# Altium schematic sheet USB.SchDoc: USB with connector
size A3; Organization: Reichle & De-Massari; Address1: Binzstrasse 32; Address2: 8620 Wetzikon; Address3: Switzerland; DocumentNumber: 6; Revision: V0.1; SheetNumber: 6; SheetTotal: 11
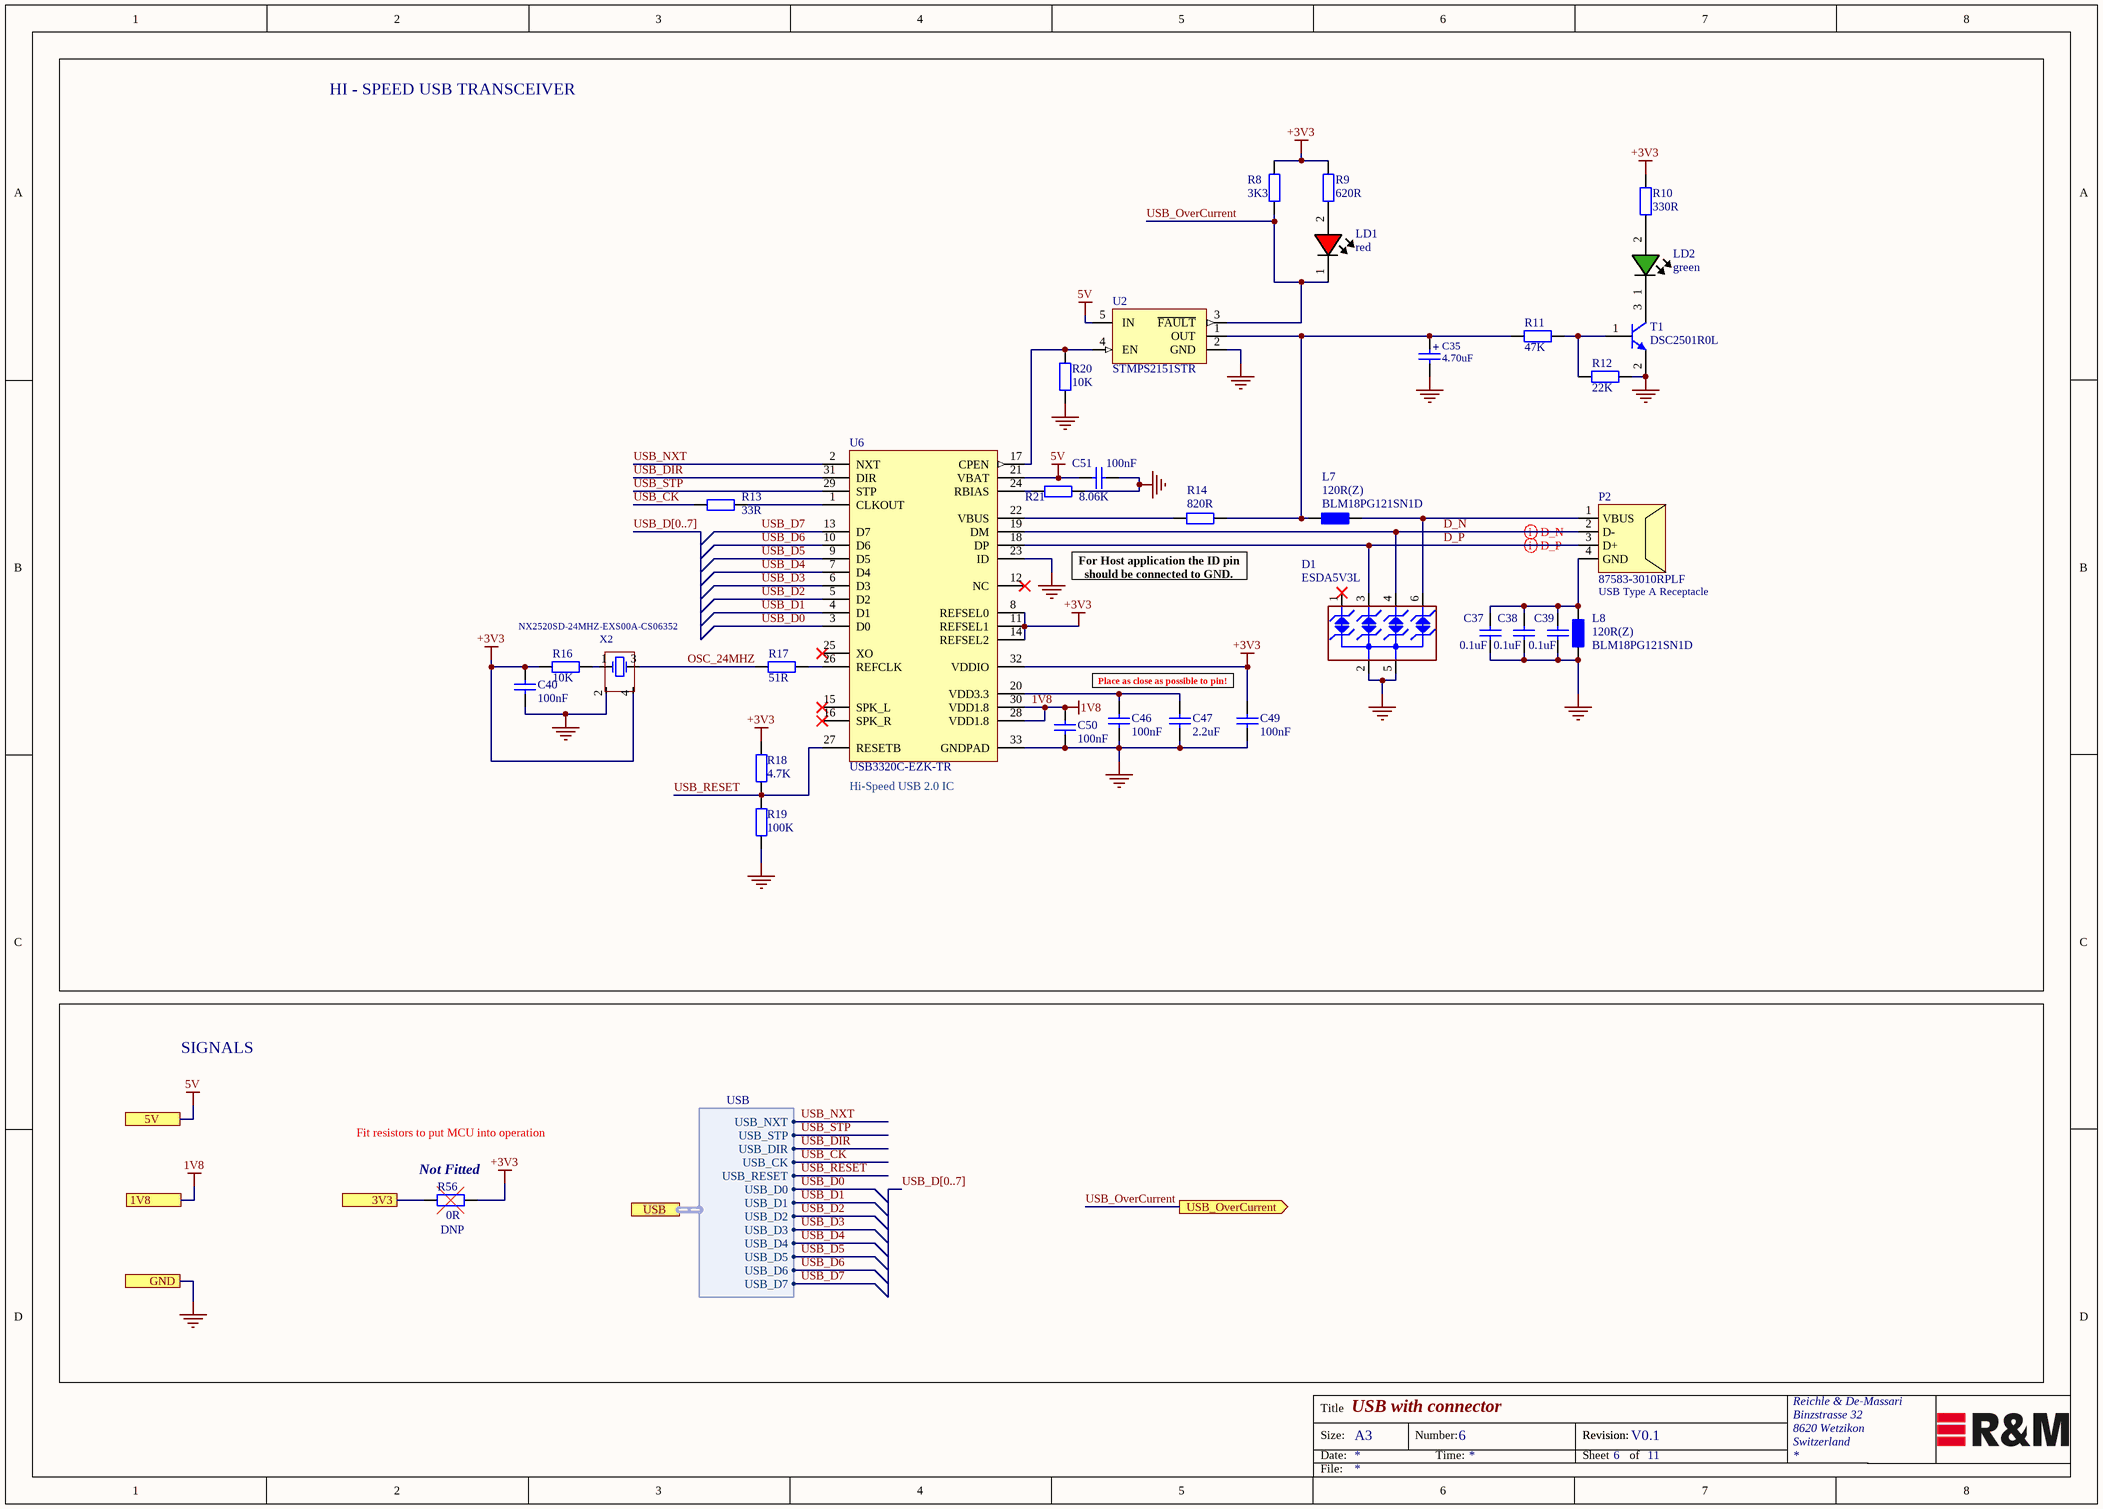
[diagram p0: USB.SchDoc]

## Parts
C35  4.70uF  [CAPC1608X90]
C37  0.1uF  [Ceramic Capacitor 0402 EIA]
C38  0.1uF  [Ceramic Capacitor 0402 EIA]
C39  0.1uF  [Ceramic Capacitor 0402 EIA]
C40  100nF  [Ceramic Capacitor 0402 EIA]
C46  100nF  [Ceramic Capacitor 0402 EIA]
C47  2.2uF  [Ceramic Capacitor 0402 EIA]
C49  100nF  [Ceramic Capacitor 0402 EIA]
C50  100nF  [Ceramic Capacitor 0402 EIA]
C51  100nF  [Ceramic Capacitor 0402 EIA]
D1  ESDA5V3L  [SOT23-6L]
L7  120R(Z)  Manufacturer PartNr: BLM18PG121SN1D  [Inductor 0603 EIA]
L8  120R(Z)  Manufacturer PartNr: BLM18PG121SN1D  [Inductor 0603 EIA]
LD1  red  [LED_APHHS1005CGCK]
LD2  green  [LED_APHHS1005CGCK]
P2  87583-3010RPLF  [CONN_RCPT_USB_TYPE_A]
R8  3K3  [Resistor 0402 EIA]
R9  620R  [Resistor 0402 EIA]
R10  330R  [Resistor 0402 EIA]
R11  47K  [Resistor 0402 EIA]
R12  22K  [Resistor 0402 EIA]
R13  33R  [Resistor 0402 EIA]
R14  820R  [Resistor 0402 EIA]
R16  10K  [Resistor 0402 EIA]
R17  51R  [Resistor 0402 EIA]
R18  4.7K  [Resistor 0402 EIA]
R19  100K  [Resistor 0402 EIA]
R20  10K  [Resistor 0402 EIA]
R21  8.06K  [Resistor 0402 EIA]
R56  DNP  [Resistor 0805 EIA]
T1  DSC2501R0L  [SOT-23/TO-236AA]
U2  STMPS2151STR  [SOT23-5L]
U6  USB3320C-EZK-TR  [QFN32_0R5_5X5]
X2  NX2520SD-24MHZ-EXS00A-CS06352  [NX2520SD-24MHZ-EX]

## Blocks framed on the sheet
HI - SPEED USB TRANSCEIVER: C35 C37-C40 C46 C47 C49-C51 D1 L7 L8 LD1 LD2 P2 R8-R14 R16-R21 T1 U2 U6 X2
SIGNALS: R56

## Ports
1V8, 3V3, 5V, GND, USB (harness USB), USB_OverCurrent (out)

## Harnesses
USB: USB_STP, USB_DIR, USB_CK, USB_NXT, USB_RESET, USB_D0, USB_D1, USB_D2, USB_D3, USB_D4, USB_D5, USB_D6, USB_D7

## Nets
1V8: C50.2 U6.28(VDD1.8) U6.30(VDD1.8) ; port 1V8
5V: C51.2 U2.5(IN) U6.21(VBAT) ; port 5V
+3V3: C40.2 C49.2 R8.2 R9.1 R10.1 R16.1 R18.1 R56.2 U6.8(REFSEL0) U6.11(REFSEL1) U6.14(REFSEL2) U6.32(VDDIO) X2.4(OSC3)
GND: C35.2(Neg) C37.1 C38.1 C39.1 C40.1 C46.1 C47.1 C49.1 C50.1 C51.1 D1.2(IO2) D1.5(IO4) L8.1 R12.2 R19.2 R20.2 R21.2 T1.2(E) U2.2(GND) U6.23(ID) U6.33(GNDPAD) X2.2(OSC2) ; port GND
3V3: R56.1 ; port 3V3
D_N: D1.4(IO3) P2.2(D-) U6.19(DM)
D_P: D1.3(GND) P2.3(D+) U6.18(DP)
OSC_24MHZ: R17.1 X2.3(OSC2)
USB_CK: R13.1 ; port USB.USB_CK
USB_D0: U6.3(D0) ; port USB.USB_D0
USB_D1: U6.4(D1) ; port USB.USB_D1
USB_D2: U6.5(D2) ; port USB.USB_D2
USB_D3: U6.6(D3) ; port USB.USB_D3
USB_D4: U6.7(D4) ; port USB.USB_D4
USB_D5: U6.9(D5) ; port USB.USB_D5
USB_D6: U6.10(D6) ; port USB.USB_D6
USB_D7: U6.13(D7) ; port USB.USB_D7
USB_DIR: U6.31(DIR) ; port USB.USB_DIR
USB_NXT: U6.2(NXT) ; port USB.USB_NXT
USB_OverCurrent: LD1.1 R8.1 U2.3(~{FAULT}) ; port USB_OverCurrent
USB_RESET: R18.2 R19.1 U6.27(RESETB) ; port USB.USB_RESET
USB_STP: U6.29(STP) ; port USB.USB_STP
NetC35_1: C35.1(Pos) L7.1 R11.1 R14.2 U2.1(OUT)
NetC37_2: C37.2 C38.2 C39.2 L8.2 P2.4(GND)
NetC46_2: C46.2 C47.2 U6.20(VDD3.3)
NetD1_6: D1.6(NC) L7.2 P2.1(VBUS)
NetLD2_2: LD2.2 R10.2
NetR11_2: R11.2 R12.1 T1.1(B)
NetR13_2: R13.2 U6.1(CLKOUT)
NetR14_1: R14.1 U6.22(VBUS)
NetR16_2: R16.2 X2.1(OSC1)
NetR17_2: R17.2 U6.26(REFCLK)
NetR20_1: R20.1 U2.4(EN) U6.17(CPEN)
NetR21_1: R21.1 U6.24(RBIAS)

Not connected (* = marked no-connect by the designer): D1 1(IO1)*; LD1 2; LD2 1; R9 2; T1 3(C); U6 12(NC)* 15(SPK_L)* 16(SPK_R)* 25(XO)*

## Buses and harness runs
bus USB_D[0..7]

## Layout directives
differential pair: D_N, D_P

## Notes on the sheet
- (near R14) For Host application the ID pin should be connected to GND.
- Place as close as possible to pin!
- (near U6) Hi-Speed USB 2.0 IC
- Fit resistors to put MCU into operation
- (near R56) Not Fitted
- (near R56) 0R
- Title
- Size:
- Date:
- A3
- Number:
- Time:
- Revision:
- Sheet
- of
- File:
- (in symbol Cap_4.7uF_0603_6V3_Tantal) +
- (in symbol CONN_USB_TYPE_A_1) USB Type A Receptacle

## Library data of the parts
C35 = Cap_4.7uF_0603_6V3_Tantal: 4.7µF Molded Tantalum Capacitors 6.3V 0603 (1608 Metric) 7.5Ohm; Manufacturer: AVX Corporation; Manufacturer PartNr: TACL475K006XTA; Replaceable: yes; tolerance: 10 %; Dielectric Grade: TAC; voltage: 6.3V; Footprint/Package: 0603 (1608 Metric); value: 4.70uF; Supplier 1: Digi-Key; Supplier Part Number 1: 478-7522-1-ND
C37-C39 = Cap_0.1uF_0402_16V: 0.1µF ±20% 16V Ceramic Capacitor X7R 0402 (1005 Metric); Manufacturer: KEMET; Manufacturer PartNr: C0402C104M4RACAUTO; voltage: 16VDC; Replaceable: yes; value: 0.1uF; tolerance: 20%; Footprint/Package: 0402 (1005 Metric); Dielectric Grade: X7R; ComponentLink1Description: mouser; ComponentLink1URL: https://www.mouser.ch/ProductDetail/KEMET/C0402C104M4RACAUTO?qs=sGAEpiMZZMs0AnBnWHyRQB295tntAovf0Dzw3tVX6zRfKTwHFThmZw%3d%3d; Supplier 1: Digi-Key; Supplier Part Number 1: 399-13707-1-ND
C40 C46 C49-C51 = Cap_100nF_0402_10V: 0,1µF ±10% 10V Keramikkondensatoren X7R 0402 (1005 metrisch); Manufacturer: Samsung; Manufacturer PartNr: CC0402KRX7R6BB104; Replaceable: yes; volatage: 10VDC; Dielectric Grade: X7R; Footprint/Package: 0402 (1005 metric); Supplier 1: Digi-Key; Supplier Part Number 1: 1276-1002-1-ND; value: 100nF
C47 = Cap_2.2uF_0402_6.3V: Multilayer Ceramic Capacitors MLCC - SMD/SMT 0402 2.2uF 6.3volts *Derate Voltage/Temp; Manufacturer: Murata; Manufacturer PartNr: GRM155R60J225ME15D; tolerance: ±20%; voltage: 6.3VDC; Replaceable: yes; Dielectric Grade: X5R; value: 2.2uF; Footprint/Package: 0402; ComponentLink1Description: digikey; ComponentLink1URL: https://www.digikey.com/product-detail/en/murata-electronics-north-america/GRM155R61E225ME15D/490-10457-2-ND/5027542; Supplier 1: Mouser; Supplier Part Number 1: 81-GRM155R60J225ME5D
D1 = ESDA6V1BC6: Clamp Ipp Tvs Diode Surface Mount SOT-23-6 SMD, used e.g in ESD protection for USB; Manufacturer: STMicroelectronics; Replaceable: no; voltage: 6.1V; value: ESDA5V3L; Manufacturer PartNr: ESDA6V1BC6; Dielectric Grade: -; Supplier Part Number 1: 497-6635-1-ND; Supplier 1: Digi-Key; Footprint/Package: SOT-23-6; tolerance: -
L7 L8 = Ferrit_Bead_0603_BLM18PG121SN1D: 120 Ohms @ 100MHz 1 Power Line Ferrite Bead 0603 (1608 Metric) 2A 50mOhm; Manufacturer: Murata Electronics; Replaceable: yes; value: 120R(Z); tolerance: -; power: -; Footprint/Package: 0603 (1608 metric); Supplier 1: Digi-Key; Supplier Part Number 1: 490-1037-1-ND; Dielectric Grade: -
LD1 = LED_RED_0402: Red 630nm LED Indication - Discrete 1.95V 0402 (1005 Metric); Manufacturer: Kingbright; Manufacturer PartNr: APHHS1005SURCK; Replaceable: yes; voltage: 1.95V (forward); Footprint/Package: 0420 (1005 metric); value: red; Supplier 1: Digi-Key; Supplier Part Number 1: 754-1104-1-ND; Dielectric Grade: -; tolerance: -; power: -
LD2 = LED_GREEN_0402: Green 570nm LED Indication - Discrete 2.1V 0402 (1005 Metric); Manufacturer: Kingbright; Manufacturer PartNr: APHHS1005CGCK; Replaceable: yes; voltage: 2.1V (forward); Footprint/Package: 0420 (1005 metric); value: green; Supplier 1: Digi-Key; Supplier Part Number 1: 754-1101-1-ND; Dielectric Grade: -; tolerance: -; power: -
P2 = CONN_USB_TYPE_A_1: USB - A USB 2.0 Receptacle Connector 4 Position Surface Mount, Right Angle; Manufacturer: Amphenol ICC; Replaceable: no; Footprint/Package: SMD, see datasheet; Supplier 1: Digi-Key; ComponentLink1Description: mouser; ComponentLink1URL: https://www.mouser.ch/ProductDetail/Harwin/M50-3030342?qs=%2fha2pyFaduiRpn7Sn9fWVp%252bNpdzGcgnS82sSCZLLu%2fUjQZVEB%252bIkNw%3d%3d; Supplier Part Number 1: 609-6260-1-ND; power: -; Dielectric Grade: -; Manufacturer PartNr: 87583-3010RPLF; voltage: -; value: 87583-3010RPLF
R8 = Res_3K3_0402: 3.3 kOhms ±0.1% 0.063W, 1/16W Chip Resistor 0402 (1005 Metric) Automotive AEC-Q200 Thin Film; Manufacturer: Panasonic Electronic Components; Manufacturer PartNr: ERA-2AEB332X; Replaceable: yes; Dielectric Grade: -; Footprint/Package: 0402 (1005metric); power: 0.063W, 1/16W; Supplier 1: Digi-Key; Supplier Part Number 1: P3.3KDCCT-ND; tolerance: ±0.1%; value: 3K3
R9 = Res_620R_0402: 620Ohm, SMD 0402,  1/16W  0.5%; Manufacturer: Susumu; Manufacturer PartNr: RR0510P-621-D; power: 62.5mW; Replaceable: yes; Footprint/Package: 0402 (1005 metric); Supplier 1: Mouser; Supplier Part Number 1: 754-RR0510P-621D; tolerance: 0.5%; value: 620R; ComponentLink1Description: mouser; ComponentLink1URL: https://www.mouser.ch/ProductDetail/Susumu/RR0510P-621-D?qs=sGAEpiMZZMu61qfTUdNhG%2fDhcyQpRg8MIBVoO7KVzPo%3d; Supplier 2: Digi-Key; Supplier Part Number 2: RR05P620DDKR-ND
R10 = Res_330R_0402: 330 Ohms ±0.1% 0.063W, 1/16W Chip Resistor 0402 (1005 Metric) Automotive AEC-Q200 Thin Film; Manufacturer: Panasonic Electronic Components; Manufacturer PartNr: ERA-2AEB331X; Replaceable: yes; Dielectric Grade: -; Footprint/Package: 0402 (1005metric); power: 0.063W, 1/16W; Supplier 1: Digi-Key; Supplier Part Number 1: P330DCCT-ND; tolerance: ±0.1%; value: 330R
R11 = Res_47K_0402: 47 kOhms ±5% 0.063W, 1/16W Chip Resistor 0402 (1005 Metric) Automotive AEC-Q200, Moisture Resistant Thick Film; Manufacturer: TE Connectivity; Manufacturer PartNr: CRGCQ0402J47K; power: 62.5mW; Replaceable: yes; Suipplier 1: Digi-Key; value: 47K; tolerance: 5%; Footprint/Package: 0402 (1005); ComponentLink1Description: mouser; ComponentLink1URL: https://www.mouser.ch/ProductDetail/Yageo/RC0402FR-07412KL?qs=sGAEpiMZZMu61qfTUdNhG6gKAQVNBKOozNOFQJr2tME%3d; Supplier Part Number 1: A130058CT-ND
R12 = Res_22K_0402: 22 kOhms ±5%  0402 (1005 metrisch) Thick Film; Manufacturer: Yageo; Manufacturer PartNr: RC0402JR-0722KL; power: 0.063W, 1/16W; Replaceable: yes; value: 22K; tolerance: 5%; Footprint/Package: 0402 (1005 metric); Supplier 1: Digi-Key; Supplier Part Number 1: 311-22KJRCT-ND
R13 = Res_33R_0402: 33 Ohms ±0.1% 0.063W, 1/16W Chip Resistor 0402 (1005 Metric) Thin Film; Manufacturer: TE Connectivity; Manufacturer PartNr: CPF0402B33RE1; Replaceable: yes; Dielectric Grade: -; Footprint/Package: 0402 (1005metric); power: 0.063W, 1/16W; Supplier 1: Digi-Key; Supplier Part Number 1: A102801CT-ND; tolerance: ±0.1%; value: 33R
R14 = Res_820R_0402: 820 Ohms ±1% 0.1W, 1/10W 0402 Thick Film; Manufacturer: Panasonic Electronic Components; Manufacturer PartNr: ERJ-2RKF8200X; Replaceable: yes; value: 820R; tolerance: 1%; power: 0.1W, 1/10W; Footprint/Package: 0402 (1005 metric); Supplier 1: Digi-Key; Supplier Part Number 1: P820LCT-ND
R16 R20 = Res_10K_0402: SMD 10K ohm 1% 50V General Purpose; Manufacturer: Yageo; Manufacturer PartNr: RC0402FR-1010KL; power: 63mW; Replaceable: yes; value: 10K; tolerance: 1%; ComponentLink1Description: mouser; ComponentLink1URL: https://www.mouser.ch/ProductDetail/Yageo/RC0402FR-1010KL?qs=sGAEpiMZZMtlubZbdhIBIEgN9MQql2m6Sb2LnYlCICU%3d; Footprint/Package: 0402; Supplier 1: Mouser; Supplier Part Number 1: 603-RC0402FR-1010KL; Supplier 2: Digi-Key; Supplier Part Number 2: *
R17 = Res_51R_0402: 51 Ohms ±5% 0.063W, 1/16W Chip Resistor 0402 (1005 Metric) , Thick Film; Manufacturer: Yageo; Manufacturer PartNr: RC0402JR-0751RL; power: 62.5mW; Replaceable: yes; value: 51R; tolerance: 5%; Footprint/Package: 0402 (1005  metric); ComponentLink1Description: mouser; ComponentLink1URL: https://www.mouser.ch/ProductDetail/Yageo/RC0402JR-0751RL?qs=sGAEpiMZZMtG0KNrPCHnjTtiZEI2zSDg2UFCMmEjZXQ%3d; Supplier 1: Farnell; Supplier 2: Mouser; Supplier 3: Digi-Key; Supplier Part Number 1: 1799298; Supplier Part Number 2: 603-RC0402JR-0751RL; Supplier Part Number 3: 311-51JRDKR-ND
R18 = Res_4K7_0402: 4.7 kOhms ±5% 0.063W, 1/16W Chip Resistor 0402 (1005 Metric) Moisture Resistant Thick Film; Manufacturer: Yageo; Manufacturer PartNr: RC0402JR-074K7L; Replaceable: yes; Suipplier 1: Digi-Key; value: 4.7K; tolerance: ±5%; power: 0.063W, 1/16W; Footprint/Package: 0402 (1005); ComponentLink1Description: mouser; ComponentLink1URL: https://www.mouser.ch/ProductDetail/Yageo/RC0402FR-07412KL?qs=sGAEpiMZZMu61qfTUdNhG6gKAQVNBKOozNOFQJr2tME%3d; Supplier Part Number 1: 311-4.7KJRCT-ND
R19 = Res_100K_0402: 100 kOhms ±0,1% 0,063W, 1/16W Chip-Widerstand 0402 (1005 metrisch) Dünnschicht; Manufacturer: Yageo; Manufacturer PartNr: RT0402BRD07100KL; tolerance: ±0.1%; Replaceable: yes; value: 100K; power: 0,063W, 1/16W; Footprint/Package: 0402 (1005 metrisch); Supplier 1: Digi-Key; Supplier Part Number 1: YAG1343CT-ND
R21 = Res_8K06_0402: 8.06 kOhms ±1% 0.063W, 1/16W Chip Resistor 0402 (1005 Metric) Moisture Resistant Thick Film; Manufacturer: Yageo; Manufacturer PartNr: 311-8.06KLRCT-ND; Replaceable: yes; Suipplier 1: Digi-Key; value: 8.06K; tolerance: ±1%; power: 0.063W, 1/16W; Footprint/Package: 0402 (1005); ComponentLink1Description: mouser; ComponentLink1URL: https://www.mouser.ch/ProductDetail/Yageo/RC0402FR-07412KL?qs=sGAEpiMZZMu61qfTUdNhG6gKAQVNBKOozNOFQJr2tME%3d; Supplier Part Number 1: RC0402FR-078K06L
R56 = Res_DNP_0805: Resistor: do not populate; Replaceable: no; value: DNP; tolerance: *; power: *; Manufacturer: do not populate; Footprint/Package: 0805; Manufacturer PartNr: do not populate
T1 = BJT_NPN_20V: Bipolar (BJT) Transistor NPN 20V 500mA 150MHz 200mW Surface Mount Mini3-G3-B-B; Manufacturer: Panasonic Electronic Components; Replaceable: no; Supplier 1: Digi-Key; Manufacturer PartNr: DSC2501R0L; Footprint/Package: TO-236-3, SC-59, SOT-23-3; Supplier Part Number 1: DSC2501R0LCT-ND; value: DSC2501R0L; voltage: 20V
U2 = STMPS2151STR: Power Switch/Driver 1:1 N-Kanal 500mA SOT-23-5,  STMicroelectronics; Replaceable: no; voltage: 2,7V ~ 5,5V; Suppplier 1: Digi-Key; Dielectric Grade: -; Manufacturer PartNr: STMPS2151STR; Manufacturer: STMicroelectronics; value: STMPS2151STR; Supplier Part Number 1: 497-6934-1-ND; Footprint/Package: SC-74A, SOT-753
U6 = USB3320C-EZK: USB3320C,  Hi-Speed USB Host, Device or OTG PHY with ULPI Low Pin Interface,  32-QFN (5x5); Manufacturer: Microchip; Replaceable: no; voltage: 1.8V ~ 3.3V; Manufacturer PartNr: USB3320C-EZK-TR; Supplier 1: Digi-Key; Dielectric Grade: -; Supplier Part Number 1: USB3320C-EZK-CT-ND; value: USB3320C-EZK-TR; power: -
X2 = CRYSTAL_4Pad_NX2520SD-24MHZ: 24MHz ±15ppm Crystal 12pF 50 Ohms 4-SMD, No Lead; Manufacturer: NDK America, Inc.; Replaceable: no; Manufacturer PartNr: NX2520SD-24MHZ-EXS00A-CS06352; Footprint/Package: 4-SMD, No Lead; Supplier 1: Digi-Key; Supplier Part Number 1: 644-1214-1-ND; ComponentLink1Description: digikey; ComponentLink1URL: https://www.digikey.com/product-detail/en/abracon-llc/ABM3-12.000MHZ-B2-T/535-9100-2-ND/675295; Load Capacitance: 12 pF; value: NX2520SD-24MHZ-EXS00A-CS06352; Dielectric Grade: -; voltage: -